# Altium project mb1225.PrjPCB (part 2 of 2)

## Sheet STM32F7.SchDoc: STM32F769NIH6 Connexion
size A3; Date: 29-OCT-2015; Author: A.B; CompanyName: STMicroelectronics; Organization: MCD/TOOLS/GNB; Address1: 12, Rue Jules HOROWITZ; Address2: 38019 Grenoble; Address3: FRANCE; DocumentNumber: MB1225; Revision: B-01; SheetNumber: 4; SheetTotal: 13; Project: STM32F769I-DISCO
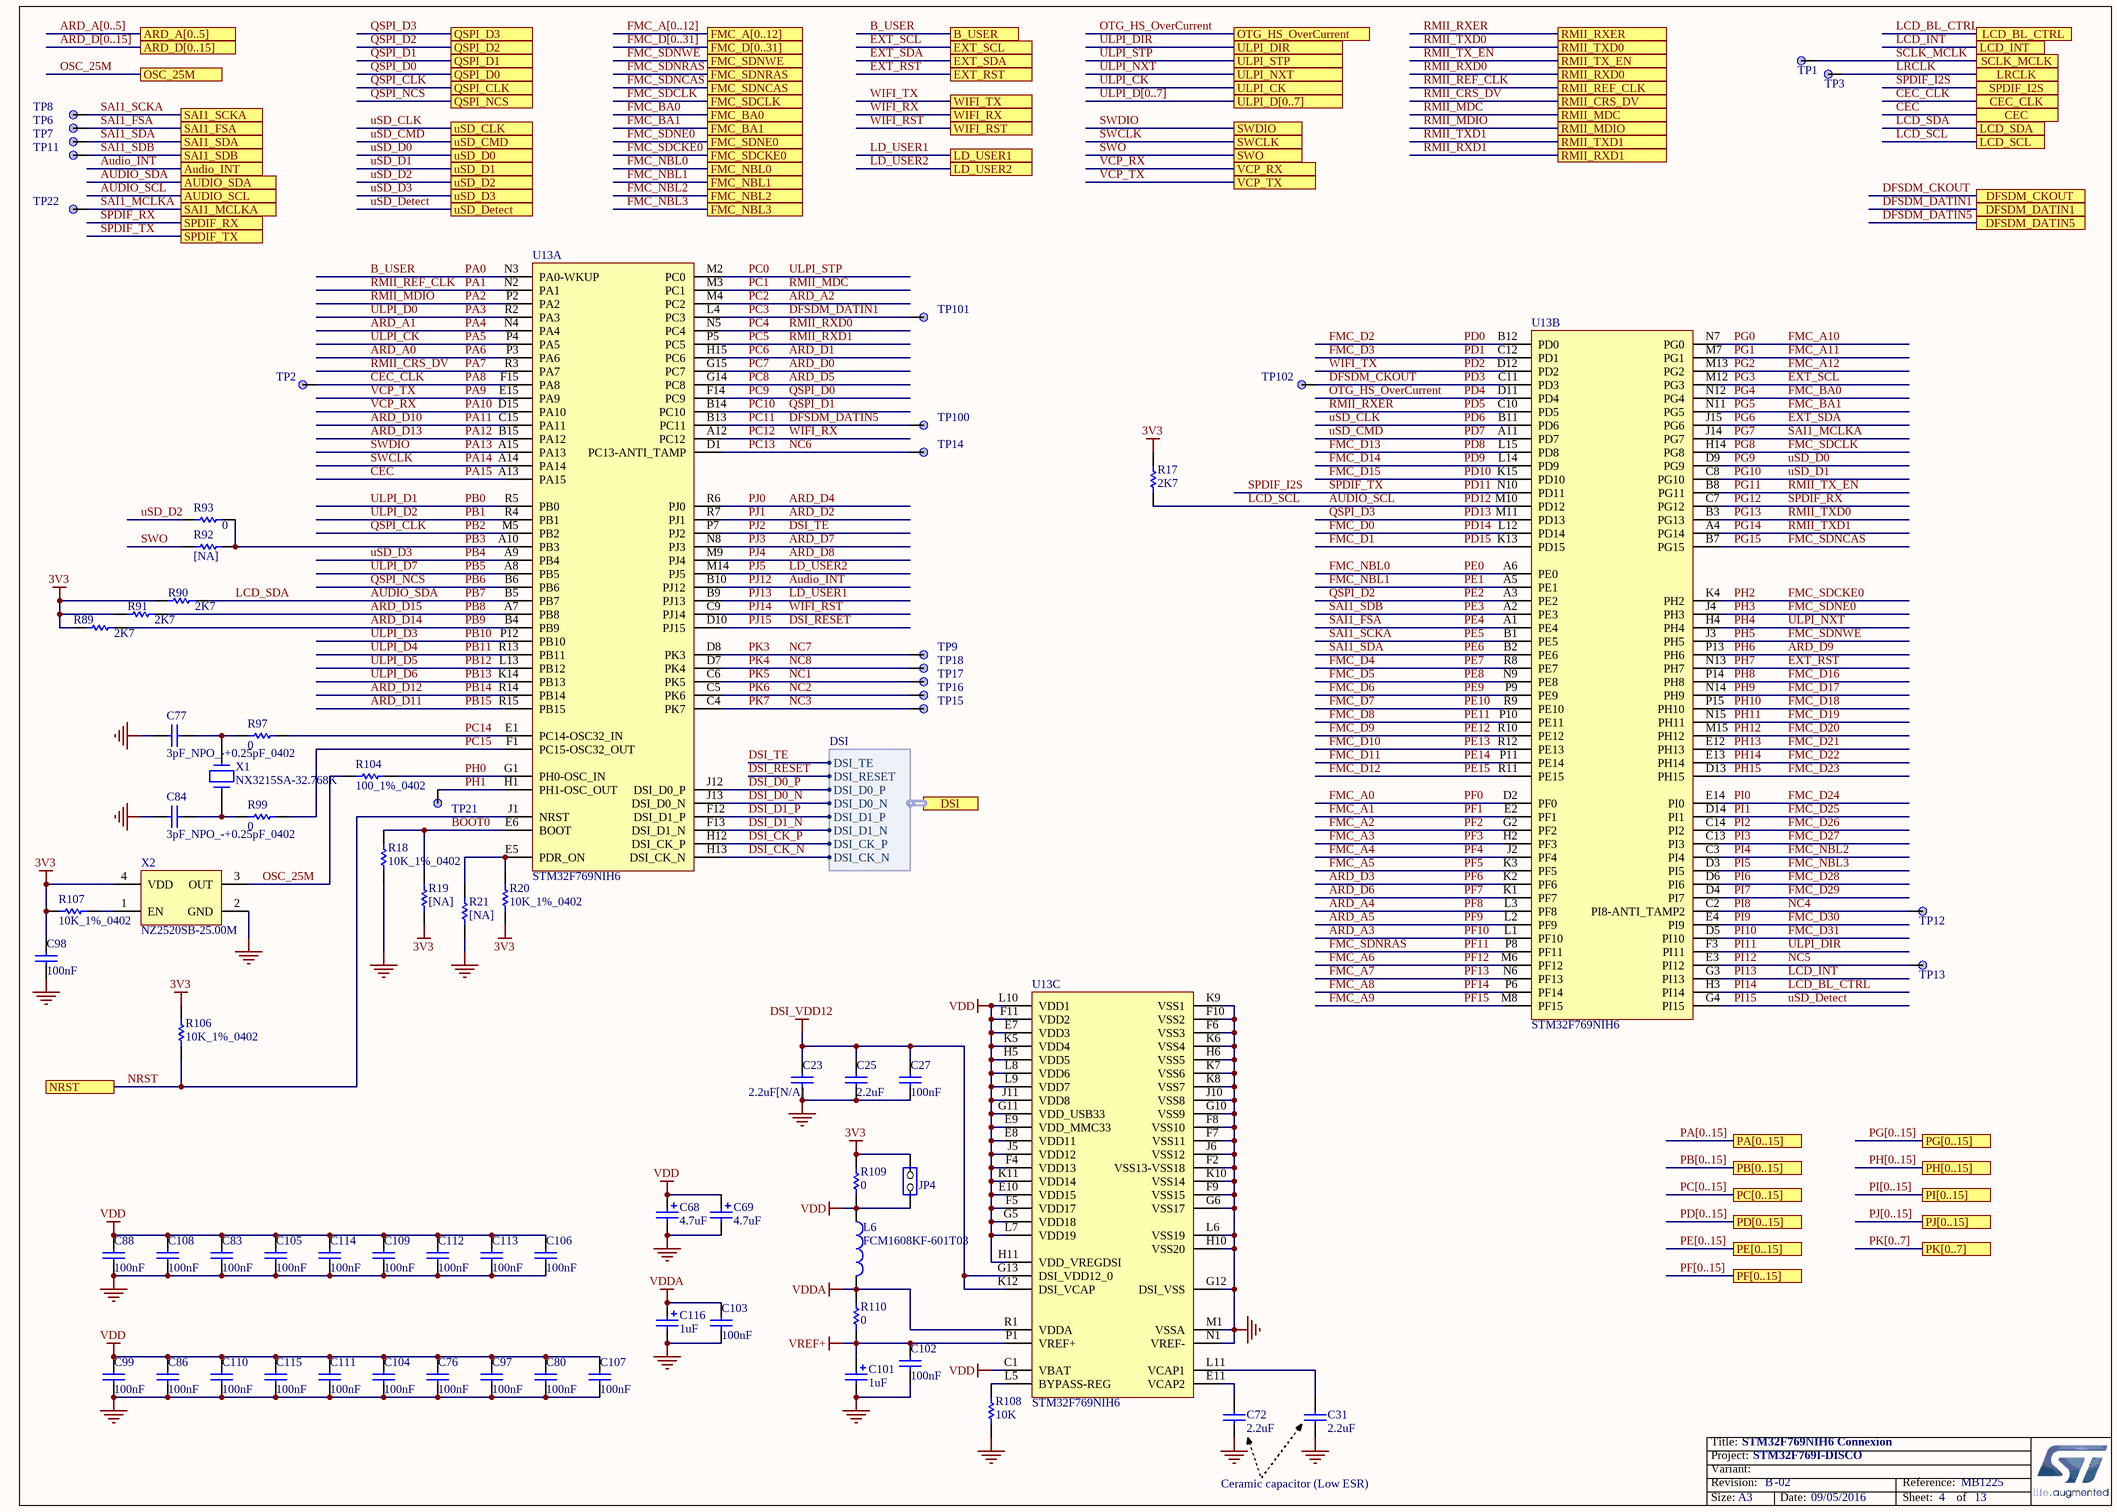
[diagram p5: STM32F7.SchDoc]

### Parts
C23  2.2uF[N/A]  [1206C]
C25  2.2uF  [0603C]
C27  100nF  [0402C]
C31  2.2uF  [1206C]
C68  4.7uF  [TAN-A]
C69  4.7uF  [TAN-A]
C72  2.2uF  [1206C]
C76  100nF  [0402C]
C77  3pF_NPO_-+0.25pF_0402  [0402C]
C80  100nF  [0402C]
C83  100nF  [0402C]
C84  3pF_NPO_-+0.25pF_0402  [0402C]
C86  100nF  [0402C]
C88  100nF  [0402C]
C97  100nF  [0402C]
C98  100nF  [0402C]
C99  100nF  [0402C]
C101  1uF  [TAN-A]
C102  100nF  [0402C]
C103  100nF  [0402C]
C104  100nF  [0402C]
C105  100nF  [0402C]
C106  100nF  [0402C]
C107  100nF  [0402C]
C108  100nF  [0402C]
C109  100nF  [0402C]
C110  100nF  [0402C]
C111  100nF  [0402C]
C112  100nF  [0402C]
C113  100nF  [0402C]
C114  100nF  [0402C]
C115  100nF  [0402C]
C116  1uF  [TAN-A]
JP4  JP2  [SIP2]  (value not drawn)
L6  FCM1608KF-601T03  [0603L]
R17  2K7  [0402R]
R18  10K_1%_0402  [0402R]
R19  [NA]  [0402R]
R20  10K_1%_0402  [0402R]
R21  [NA]  [0402R]
R89  2K7  [0402R]
R90  2K7  [0402R]
R91  2K7  [0402R]
R92  [NA]  [0402R]
R93  0  [0402R]
R97  0  [0402R]
R99  0  [0402R]
R104  100_1%_0402  [0402R]
R106  10K_1%_0402  [0402R]
R107  10K_1%_0402  [0402R]
R108  10K  [0402R]
R109  0  [0603R-GS]
R110  0  [0603R-GS]
TP1  TP  [TP_C40]  (value not drawn)
TP2  TP  [TP_C40]  (value not drawn)
TP3  TP  [TP_C40]  (value not drawn)
TP6  TP  [TP_C40]  (value not drawn)
TP7  TP  [TP_C40]  (value not drawn)
TP8  TP  [TP_C40]  (value not drawn)
TP9  TP  [TP_C40]  (value not drawn)
TP11  TP  [TP_C40]  (value not drawn)
TP12  TP  [TP_C40]  (value not drawn)
TP13  TP  [TP_C40]  (value not drawn)
TP14  TP  [TP_C40]  (value not drawn)
TP15  TP  [TP_C40]  (value not drawn)
TP16  TP  [TP_C40]  (value not drawn)
TP17  TP  [TP_C40]  (value not drawn)
TP18  TP  [TP_C40]  (value not drawn)
TP21  TP  [TP_C40]  (value not drawn)
TP22  TP  [TP_C40]  (value not drawn)
TP100  TP  [TP_C40]  (value not drawn)
TP101  TP  [TP_C40]  (value not drawn)
TP102  TP  [TP_C40]  (value not drawn)
U13  STM32F769NIH6  [BGA216_0R8_13X13]  (parts A,B,C of 3)
X1  NX3215SA-32.768K  [XTAL_2SM_3R2X1R5]
X2  NZ2520SB-25.00M  [OSC_4SM_2R5X2]

### Ports
ARD_A[0..5], ARD_D[0..15], Audio_INT, AUDIO_SCL, AUDIO_SDA, B_USER, CEC, CEC_CLK, DFSDM_CKOUT, DFSDM_DATIN1, DFSDM_DATIN5, DSI (harness DSI), EXT_RST, EXT_SCL, EXT_SDA, FMC_A[0..12], FMC_BA0, FMC_BA1, FMC_D[0..31], FMC_NBL0, FMC_NBL1, FMC_NBL2, FMC_NBL3, FMC_SDCKE0, FMC_SDCLK, FMC_SDNCAS, FMC_SDNE0, FMC_SDNRAS, FMC_SDNWE, LCD_BL_CTRL, LCD_INT, LCD_SCL, LCD_SDA, LD_USER1, LD_USER2, LRCLK, NRST, OSC_25M, OTG_HS_OverCurrent, PA[0..15], PB[0..15], PC[0..15], PD[0..15], PE[0..15], PF[0..15], PG[0..15], PH[0..15], PI[0..15], PJ[0..15], PK[0..7], QSPI_CLK, QSPI_D0, QSPI_D1, QSPI_D2, QSPI_D3, QSPI_NCS, RMII_CRS_DV, RMII_MDC, RMII_MDIO, RMII_REF_CLK, RMII_RXD0, RMII_RXD1, RMII_RXER, RMII_TX_EN, RMII_TXD0, RMII_TXD1, SAI1_FSA, SAI1_MCLKA, SAI1_SCKA, SAI1_SDA, SAI1_SDB, SCLK_MCLK, SPDIF_I2S, SPDIF_RX, SPDIF_TX, SWCLK, SWDIO, SWO, ULPI_CK, ULPI_D[0..7], ULPI_DIR, ULPI_NXT, ULPI_STP, uSD_CLK, uSD_CMD, uSD_D0, uSD_D1, uSD_D2, uSD_D3, uSD_Detect, VCP_RX, VCP_TX, WIFI_RST, WIFI_RX, WIFI_TX

### Harnesses
DSI: DSI_CK_P, DSI_CK_N, DSI_D0_P, DSI_D0_N, DSI_D1_P, DSI_D1_N, DSI_TE, DSI_RESET

### Nets
3V3: C98.2 JP4.2(NO) R17.2 R19.1 R20.1 R89.1 R90.1 R91.1 R106.2 R107.1 R109.2 X2.4(VDD)
DSI_VDD12: C23.2 C25.2 C27.2 U13.G13(DSI_VDD12_0) U13.K12(DSI_VCAP)
GND: C23.1 C25.1 C27.1 C31.1 C68.2 C69.2 C72.1 C76.1 C77.1 C80.1 C83.1 C84.1 C86.1 C88.1 C97.1 C98.1 C99.1 C101.2 C102.1 C103.1 C104.1 C105.1 C106.1 C107.1 C108.1 C109.1 C110.1 C111.1 C112.1 C113.1 C114.1 C115.1 C116.2 R18.1 R21.1 R108.1 U13.F2(VSS13-VSS18) U13.F6(VSS3) U13.F7(VSS11) U13.F8(VSS10) U13.F9(VSS15) U13.F10(VSS2) U13.G6(VSS17) U13.G10(VSS9) U13.G12(DSI_VSS) U13.H6(VSS5) U13.H10(VSS20) U13.J6(VSS12) U13.J10(VSS8) U13.K6(VSS4) U13.K7(VSS6) U13.K8(VSS7) U13.K9(VSS1) U13.K10(VSS14) U13.L6(VSS19) U13.M1(VSSA) U13.N1(VREF-) X2.2(GND)  [project net POE7]
VDD: C68.1 C69.1 C76.2 C80.2 C83.2 C86.2 C88.2 C97.2 C99.2 C104.2 C105.2 C106.2 C107.2 C108.2 C109.2 C110.2 C111.2 C112.2 C113.2 C114.2 C115.2 JP4.1(COMMON) L6.1 R109.1 U13.C1(VBAT) U13.E7(VDD3) U13.E8(VDD11) U13.E9(VDD_MMC33) U13.E10(VDD15) U13.F4(VDD13) U13.F5(VDD17) U13.F11(VDD2) U13.G5(VDD18) U13.G11(VDD_USB33) U13.H5(VDD5) U13.H11(VDD_VREGDSI) U13.J5(VDD12) U13.J11(VDD8) U13.K5(VDD4) U13.K11(VDD14) U13.L7(VDD19) U13.L8(VDD6) U13.L9(VDD7) U13.L10(VDD1)
VDDA: C103.2 C116.1 L6.2 R110.1 U13.R1(VDDA)
VREF+: C101.1 C102.2 R110.2 U13.P1(VREF+)
ARD_A0: U13.P3(PA6)  [also labelled PA6]
ARD_A1: U13.N4(PA4)  [also labelled PA4]
ARD_A2: U13.M4(PC2)  [also labelled PC2]
ARD_A3: U13.L1(PF10)  [also labelled PF10]
ARD_A4: U13.L3(PF8)  [also labelled PF8]
ARD_A5: U13.L2(PF9)  [also labelled PF9]
ARD_D0: U13.G15(PC7)  [also labelled PC7]
ARD_D1: U13.H15(PC6)  [also labelled PC6]
ARD_D2: U13.R7(PJ1)  [also labelled PJ1]
ARD_D3: U13.K2(PF6)  [also labelled PF6]
ARD_D4: U13.R6(PJ0)  [also labelled PJ0]
ARD_D5: U13.G14(PC8)  [also labelled PC8]
ARD_D6: U13.K1(PF7)  [also labelled PF7]
ARD_D7: U13.N8(PJ3)  [also labelled PJ3]
ARD_D8: U13.M9(PJ4)  [also labelled PJ4]
ARD_D9: U13.P13(PH6)  [also labelled PH6]
ARD_D10: U13.C15(PA11)  [also labelled PA11]
ARD_D11: U13.R15(PB15)  [also labelled PB15]
ARD_D12: U13.R14(PB14)  [also labelled PB14]
ARD_D13: U13.B15(PA12)  [also labelled PA12]
ARD_D14: R89.2 U13.B4(PB9)  [also labelled PB9]
ARD_D15: R91.2 U13.A7(PB8)  [also labelled PB8]
Audio_INT: U13.B10(PJ12) ; port Audio_INT  [also labelled PJ12]
AUDIO_SCL: R17.1 U13.M10(PD12) ; port AUDIO_SCL, port LCD_SCL  [also labelled LCD_SCL, PD12]
AUDIO_SDA: R90.2 U13.B5(PB7) ; port AUDIO_SDA, port LCD_SDA  [also labelled LCD_SDA, PB7]
B_USER: U13.N3(PA0-WKUP) ; port B_USER  [also labelled PA0]
BOOT0: R18.2 R19.2 U13.E6(BOOT)
CEC: U13.A13(PA15) ; port CEC  [also labelled PA15]
CEC_CLK: TP2.1 U13.F15(PA8) ; port CEC_CLK  [also labelled PA8]
DFSDM_CKOUT: TP102.1 U13.C11(PD3) ; port DFSDM_CKOUT  [also labelled PD3]
DFSDM_DATIN1: TP101.1 U13.L4(PC3) ; port DFSDM_DATIN1  [also labelled PC3]
DFSDM_DATIN5: TP100.1 U13.B13(PC11) ; port DFSDM_DATIN5  [also labelled PC11]
DSI_CK_N: U13.H13(DSI_CK_N) ; port DSI.DSI_CK_N  [project net DSI.DSI_CK_N]
DSI_CK_P: U13.H12(DSI_CK_P) ; port DSI.DSI_CK_P  [project net DSI.DSI_CK_P]
DSI_D0_N: U13.J13(DSI_D0_N) ; port DSI.DSI_D0_N  [project net DSI.DSI_D0_N]
DSI_D0_P: U13.J12(DSI_D0_P) ; port DSI.DSI_D0_P  [project net DSI.DSI_D0_P]
DSI_D1_N: U13.F13(DSI_D1_N) ; port DSI.DSI_D1_N  [project net DSI.DSI_D1_N]
DSI_D1_P: U13.F12(DSI_D1_P) ; port DSI.DSI_D1_P  [project net DSI.DSI_D1_P]
DSI_RESET: U13.D10(PJ15) ; port DSI.DSI_RESET  [also labelled PJ15]  [project net DSI.DSI_RESET]
DSI_TE: U13.P7(PJ2) ; port DSI.DSI_TE  [also labelled PJ2]  [project net DSI.DSI_TE]
EXT_RST: U13.N13(PH7) ; port EXT_RST  [also labelled PH7]
EXT_SCL: U13.M12(PG3) ; port EXT_SCL  [also labelled PG3]
EXT_SDA: U13.J15(PG6) ; port EXT_SDA  [also labelled PG6]
FMC_A0: U13.D2(PF0)  [also labelled PF0]
FMC_A1: U13.E2(PF1)  [also labelled PF1]
FMC_A2: U13.G2(PF2)  [also labelled PF2]
FMC_A3: U13.H2(PF3)  [also labelled PF3]
FMC_A4: U13.J2(PF4)  [also labelled PF4]
FMC_A5: U13.K3(PF5)  [also labelled PF5]
FMC_A6: U13.M6(PF12)  [also labelled PF12]
FMC_A7: U13.N6(PF13)  [also labelled PF13]
FMC_A8: U13.P6(PF14)  [also labelled PF14]
FMC_A9: U13.M8(PF15)  [also labelled PF15]
FMC_A10: U13.N7(PG0)  [also labelled PG0]
FMC_A11: U13.M7(PG1)  [also labelled PG1]
FMC_A12: U13.M13(PG2)  [also labelled PG2]
FMC_BA0: U13.N12(PG4) ; port FMC_BA0  [also labelled PG4]
FMC_BA1: U13.N11(PG5) ; port FMC_BA1  [also labelled PG5]
FMC_D0: U13.L12(PD14)  [also labelled PD14]
FMC_D1: U13.K13(PD15)  [also labelled PD15]
FMC_D2: U13.B12(PD0)  [also labelled PD0]
FMC_D3: U13.C12(PD1)  [also labelled PD1]
FMC_D4: U13.R8(PE7)  [also labelled PE7]
FMC_D5: U13.N9(PE8)  [also labelled PE8]
FMC_D6: U13.P9(PE9)  [also labelled PE9]
FMC_D7: U13.R9(PE10)  [also labelled PE10]
FMC_D8: U13.P10(PE11)  [also labelled PE11]
FMC_D9: U13.R10(PE12)  [also labelled PE12]
FMC_D10: U13.R12(PE13)  [also labelled PE13]
FMC_D11: U13.P11(PE14)  [also labelled PE14]
FMC_D12: U13.R11(PE15)  [also labelled PE15]
FMC_D13: U13.L15(PD8)  [also labelled PD8]
FMC_D14: U13.L14(PD9)  [also labelled PD9]
FMC_D15: U13.K15(PD10)  [also labelled PD10]
FMC_D16: U13.P14(PH8)  [also labelled PH8]
FMC_D17: U13.N14(PH9)  [also labelled PH9]
FMC_D18: U13.P15(PH10)  [also labelled PH10]
FMC_D19: U13.N15(PH11)  [also labelled PH11]
FMC_D20: U13.M15(PH12)  [also labelled PH12]
FMC_D21: U13.E12(PH13)  [also labelled PH13]
FMC_D22: U13.E13(PH14)  [also labelled PH14]
FMC_D23: U13.D13(PH15)  [also labelled PH15]
FMC_D24: U13.E14(PI0)  [also labelled PI0]
FMC_D25: U13.D14(PI1)  [also labelled PI1]
FMC_D26: U13.C14(PI2)  [also labelled PI2]
FMC_D27: U13.C13(PI3)  [also labelled PI3]
FMC_D28: U13.D6(PI6)  [also labelled PI6]
FMC_D29: U13.D4(PI7)  [also labelled PI7]
FMC_D30: U13.E4(PI9)  [also labelled PI9]
FMC_D31: U13.D5(PI10)  [also labelled PI10]
FMC_NBL0: U13.A6(PE0) ; port FMC_NBL0  [also labelled PE0]
FMC_NBL1: U13.A5(PE1) ; port FMC_NBL1  [also labelled PE1]
FMC_NBL2: U13.C3(PI4) ; port FMC_NBL2  [also labelled PI4]
FMC_NBL3: U13.D3(PI5) ; port FMC_NBL3  [also labelled PI5]
FMC_SDCKE0: U13.K4(PH2) ; port FMC_SDCKE0  [also labelled PH2]
FMC_SDCLK: U13.H14(PG8) ; port FMC_SDCLK  [also labelled PG8]
FMC_SDNCAS: U13.B7(PG15) ; port FMC_SDNCAS  [also labelled PG15]
FMC_SDNE0: U13.J4(PH3) ; port FMC_SDNE0  [also labelled PH3]
FMC_SDNRAS: U13.P8(PF11) ; port FMC_SDNRAS  [also labelled PF11]
FMC_SDNWE: U13.J3(PH5) ; port FMC_SDNWE  [also labelled PH5]
LCD_BL_CTRL: U13.H3(PI14) ; port LCD_BL_CTRL  [also labelled PI14]
LCD_INT: U13.G3(PI13) ; port LCD_INT  [also labelled PI13]
LD_USER1: U13.B9(PJ13) ; port LD_USER1  [also labelled PJ13]
LD_USER2: U13.M14(PJ5) ; port LD_USER2  [also labelled PJ5]
LRCLK: TP3.1 ; port LRCLK
NC1: TP17.1 U13.C6(PK5)  [also labelled PK5]
NC2: TP16.1 U13.C5(PK6)  [also labelled PK6]
NC3: TP15.1 U13.C4(PK7)  [also labelled PK7]
NC4: TP12.1 U13.C2(PI8-ANTI_TAMP2)  [also labelled PI8]
NC5: TP13.1 U13.E3(PI12)  [also labelled PI12]
NC6: TP14.1 U13.D1(PC13-ANTI_TAMP)  [also labelled PC13]
NC7: TP9.1 U13.D8(PK3)  [also labelled PK3]
NC8: TP18.1 U13.D7(PK4)  [also labelled PK4]
NRST: R106.1 U13.J1(NRST) ; port NRST
OSC_25M: R104.1 X2.3(OUT) ; port OSC_25M
OTG_HS_OverCurrent: U13.D11(PD4) ; port OTG_HS_OverCurrent  [also labelled PD4]
PA1: U13.N2(PA1) ; port RMII_REF_CLK  [also labelled RMII_REF_CLK]
PA2: U13.P2(PA2) ; port RMII_MDIO  [also labelled RMII_MDIO]
PA3: U13.R2(PA3)  [also labelled ULPI_D0]
PA5: U13.P4(PA5) ; port ULPI_CK  [also labelled ULPI_CK]
PA7: U13.R3(PA7) ; port RMII_CRS_DV  [also labelled RMII_CRS_DV]
PA9: U13.E15(PA9) ; port VCP_TX  [also labelled VCP_TX]
PA10: U13.D15(PA10) ; port VCP_RX  [also labelled VCP_RX]
PA13: U13.A15(PA13) ; port SWDIO  [also labelled SWDIO]
PA14: U13.A14(PA14) ; port SWCLK  [also labelled SWCLK]
PB0: U13.R5(PB0)  [also labelled ULPI_D1]
PB1: U13.R4(PB1)  [also labelled ULPI_D2]
PB2: U13.M5(PB2) ; port QSPI_CLK  [also labelled QSPI_CLK]
PB3: R92.2 R93.2 U13.A10(PB3)
PB4: U13.A9(PB4) ; port uSD_D3  [also labelled uSD_D3]
PB5: U13.A8(PB5)  [also labelled ULPI_D7]
PB6: U13.B6(PB6) ; port QSPI_NCS  [also labelled QSPI_NCS]
PB10: U13.P12(PB10)  [also labelled ULPI_D3]
PB11: U13.R13(PB11)  [also labelled ULPI_D4]
PB12: U13.L13(PB12)  [also labelled ULPI_D5]
PB13: U13.K14(PB13)  [also labelled ULPI_D6]
PC0: U13.M2(PC0) ; port ULPI_STP  [also labelled ULPI_STP]
PC1: U13.M3(PC1) ; port RMII_MDC  [also labelled RMII_MDC]
PC4: U13.N5(PC4) ; port RMII_RXD0  [also labelled RMII_RXD0]
PC5: U13.P5(PC5) ; port RMII_RXD1  [also labelled RMII_RXD1]
PC9: U13.F14(PC9) ; port QSPI_D0  [also labelled QSPI_D0]
PC10: U13.B14(PC10) ; port QSPI_D1  [also labelled QSPI_D1]
PC12: U13.A12(PC12) ; port WIFI_RX  [also labelled WIFI_RX]
PC14: R97.2 U13.E1(PC14-OSC32_IN)
PC15: R99.2 U13.F1(PC15-OSC32_OUT)
PD2: U13.D12(PD2) ; port WIFI_TX  [also labelled WIFI_TX]
PD5: U13.C10(PD5) ; port RMII_RXER  [also labelled RMII_RXER]
PD6: U13.B11(PD6) ; port uSD_CLK  [also labelled uSD_CLK]
PD7: U13.A11(PD7) ; port uSD_CMD  [also labelled uSD_CMD]
PD11: U13.N10(PD11) ; port SPDIF_TX, port SPDIF_I2S  [also labelled SPDIF_I2S, SPDIF_TX]
PD13: U13.M11(PD13) ; port QSPI_D3  [also labelled QSPI_D3]
PE2: U13.A3(PE2) ; port QSPI_D2  [also labelled QSPI_D2]
PE3: TP11.1 U13.A2(PE3) ; port SAI1_SDB  [also labelled SAI1_SDB]
PE4: TP6.1 U13.A1(PE4) ; port SAI1_FSA  [also labelled SAI1_FSA]
PE5: TP8.1 U13.B1(PE5) ; port SAI1_SCKA  [also labelled SAI1_SCKA]
PE6: TP7.1 U13.B2(PE6) ; port SAI1_SDA  [also labelled SAI1_SDA]
PG7: TP22.1 U13.J14(PG7) ; port SAI1_MCLKA  [also labelled SAI1_MCLKA]
PG9: U13.D9(PG9) ; port uSD_D0  [also labelled uSD_D0]
PG10: U13.C8(PG10) ; port uSD_D1  [also labelled uSD_D1]
PG11: U13.B8(PG11) ; port RMII_TX_EN  [also labelled RMII_TX_EN]
PG12: U13.C7(PG12) ; port SPDIF_RX  [also labelled SPDIF_RX]
PG13: U13.B3(PG13) ; port RMII_TXD0  [also labelled RMII_TXD0]
PG14: U13.A4(PG14) ; port RMII_TXD1  [also labelled RMII_TXD1]
PH0: R104.2 U13.G1(PH0-OSC_IN)
PH1: TP21.1 U13.H1(PH1-OSC_OUT)
PH4: U13.H4(PH4) ; port ULPI_NXT  [also labelled ULPI_NXT]
PI11: U13.F3(PI11) ; port ULPI_DIR  [also labelled ULPI_DIR]
PI15: U13.G4(PI15) ; port uSD_Detect  [also labelled uSD_Detect]
PJ14: U13.C9(PJ14) ; port WIFI_RST  [also labelled WIFI_RST]
SCLK_MCLK: TP1.1 ; port SCLK_MCLK
SWO: R92.1 ; port SWO
uSD_D2: R93.1 ; port uSD_D2
NetC31_2: C31.2 U13.L11(VCAP1)
NetC72_2: C72.2 U13.E11(VCAP2)
NetC77_2: C77.2 R97.1 X1.1
NetC84_2: C84.2 R99.1 X1.2
NetR20_2: R20.2 R21.2 U13.E5(PDR_ON)
NetR107_2: R107.2 X2.1(EN)
NetR108_2: R108.2 U13.L5(BYPASS-REG)

### Buses and harness runs
bus ARD_A[0..5] = port ARD_A[0..5]
bus ARD_D[0..15] = port ARD_D[0..15]
bus FMC_A[0..12] = port FMC_A[0..12]
bus FMC_D[0..31] = port FMC_D[0..31]
bus PA[0..15] = port PA[0..15]
bus PB[0..15] = port PB[0..15]
bus PC[0..15] = port PC[0..15]
bus PD[0..15] = port PD[0..15]
bus PE[0..15] = port PE[0..15]
bus PF[0..15] = port PF[0..15]
bus PG[0..15] = port PG[0..15]
bus PH[0..15] = port PH[0..15]
bus PI[0..15] = port PI[0..15]
bus PJ[0..15] = port PJ[0..15]
bus PK[0..7] = port PK[0..7]
bus ULPI_D[0..7] = port ULPI_D[0..7]

### Notes on the sheet
- Ceramic capacitor (Low ESR)
- Title:
- Project:
- Size:
- Revision:
- Variant:
- A3
- -
- Date:
- Reference:
- Sheet:
- of

### Library data of the parts
C23 = Cap_2.2uF_X7R_10%_1206: Capacitor,2.2uF,16V, X7R,10%,1206,YAGEO; Manuf_Part_1: CC1206KKX7R7BB225; Manuf_Part_2: C1206C225K4RAC; Manuf_2: KEMET; Fitted: NO; Revision: July-2002: Re-released for DXP Platform.; Value: 2.2uF; Order: CC1206KKX7R7BB225; Manuf_1: YAGEO; ECCN_US/EU: n/a
C25 = Cap_2.2uF_X5R_10%_0603: Capacitor,2.2uF,10V, X5R,10%,0603,YAGEO; Manuf_Part_1: CC0603KRX5R6BB225; Manuf_Part_2: C0603C225K8PACTU; Manuf_2: KEMET; Revision: July-2002: Re-released for DXP Platform.; Value: 2.2uF; Order: *; Manuf_1: YAGEO; ECCN_US/EU: n/a
C27 C76 C80 C83 C86 C88 C97-C99 C102-C115 = Cap_100nF_X7R_10%_0402: Capacitor,100nF,16V,X7R,10%,0402,YAGEO; Manuf_Part_1: CC0402KRX7R7BB104; Revision: July-2002: Re-released for DXP Platform.; Value: 100nF; Order: CC0402KRX7R7BB104; Manuf_1: YAGEO
  C27: ECCN_US/EU: n/a
C31 C72 = Cap_2.2uF_X7R_10%_1206: Capacitor,2.2uF,16V, X7R,10%,1206,YAGEO; Manuf_Part_1: CC1206KKX7R7BB225; Manuf_Part_2: C1206C225K4RAC; Manuf_2: KEMET; Revision: July-2002: Re-released for DXP Platform.; Value: 2.2uF; Order: CC1206KKX7R7BB225; Manuf_1: YAGEO; ECCN_US/EU: n/a
C68 C69 = Cap_4.7uF_POL_10%_TANA: Polarized Capacitor,4.7uF,16V,10%,typeA,AVX; Manuf_Part_1: TAJA475K016R; Revision: July-2002: Re-released for DXP Platform.; Value: 4.7uF; Manuf_1: AVX; Order: TAJA475K016R; ECCN_US/EU: n/a
C77 C84 = Cap_4.3pF_NPO_-+0.25pF_0402: Capacitor, 3pF, 16V, NPO, -+0.25pF, 0402, KEMET; Manuf_1: AVX; Manuf_Part_1: C0402C439C4GACTU; Order: C0402C439C4GACTU-ND; Revision: July-2002: Re-released for DXP Platform.; Value: 3pF; ECCN_US/EU: n/a; Distrib: DIGIKEY
C101 C116 = Cap_1uF_POL_10%_TANA: Polarized Capacitor,1uF,16V,10%,typeA,AVX; Manuf_Part_1: TAJA105K016R; Revision: July-2002: Re-released for DXP Platform.; Value: 1uF; Manuf_1: AVX; Distrib: *; Order: TAJA105K016R; ECCN_US/EU: n/a
JP4 = JP2: Fitted: NO; ECCN_US/EU: n/a
L6 = BEAD_600R_350MA_0603: Bead,600R,350mA,0603,FCM1608KF-601T03,Tai-tech; Manuf_2: TDK; Manuf_Part_2: MPZ1608S300A; Manuf_Part_3: BLM18PG121SN1D; Manuf_3: MURATA; Value: 100uH; Description_2: Bead,30R,5A,0603,MPZ1608S300A,TDK; Description_3: Bead,120R,2A,0603,BLM18PG121SN1D,MURATA; Revision: July-2002: Re-released for DXP Platform.; Manuf_Part_1: FCM1608KF-601T03; Manuf_1: Tai-tech; ECCN_US/EU: n/a
R17 R89-R91 = Res_2K7_1%_0402: Resistor,2K7,0402,1%,YAGEO; Manuf_Part_1: RC0402FR-072K7L; Value: 2K7; Manuf_1: YAGEO; Order: RC0402FR-072K7L; ECCN_US/EU: n/a; Distrib: FARNELL
R18 R20 R106-R108 = Res_10K_1%_0402: Resistor,10K,0402,1%,YAGEO; Manuf_Part_1: RC0402FR-0710KL; Value: 10K; Manuf_1: YAGEO; Order: RC0402FR-0710KL; ECCN_US/EU: n/a
R19 R21 R92 = Res_NA_0402: Resistor,[NA],0402; Fitted: NO; Value: [NA]; ECCN_US/EU: n/a
R93 R97 R99 = Res_0_5%_0402: Resistor,0,0402,5%,YAGEO; Manuf_Part_1: RC0402JR-070RL; Order: 2363467; Value: 0; ECCN_US/EU: n/a; Manuf_1: YAGEO; Distrib: FARNELL
R104 = Res_100_1%_0402: Resistor,100,0402,1%,YAGEO; Manuf_Part_1: RC0402FR-07100RL; Value: 100; Order: 9239111; Manuf_1: YAGEO; ECCN_US/EU: n/a; Distrib: FARNELL
R109 R110 = Res_0_5%_0603: Resistor,0,0603,5%,YAGEO; Manuf_Part_1: RC0603JR-070RL; Order: 2363481; Value: 0; ECCN_US/EU: n/a; Manuf_1: YAGEO; Distrib: FARNELL
TP1-TP3 TP6-TP9 TP11-TP18 TP21 TP22 TP100-TP102 = TP: Test Point; ECCN_US/EU: n/a
U13 = STM32F769NIH6U: STM32F769NIH6 (STM32F7 Big Birdie) TBGA216; Manuf_1: STM; ECCN_US/EU: 3A991A2/NEC; Ref St: xxxxxxxx; Provided: ST; Distrib: ST; Manuf_Part_1: STM32F769NIH6U; Order: STM32F769NIH6U
X1 = XTAL_32K_NX3215SA: Crystal 32.768kHz, 6pF, -+20PPM, R=50K, SMD; Manuf_1: NDK; Manuf_Part_1: NX3215SA 32.768KHz EXS00A-MU00525; ECCN_US/EU: EAR99/NEC; Ref St: 9157034; NDK Ref: X3101802; Provided: ST; Distrib: *; Order: NX3215SA 32.768KHz EXS00A-MU00525
X2 = OSC_25M_NZ2520SB: Oscillator 25.00Mhz, -+50PPM, 3.3V, Temp -55 to +125°C; Manuf_Part_1: NZ2520SB 25MHz END4869B; Manuf_1: NDK; Manuf_Part_2: KC2520B25.0000C10E00; Manuf_2: AVX Corp/Kyocera Corp; ECCN_US/EU: EAR99/NEC; Ref St: 9157031; Provided: ST; Order: *

## Sheet DSI_LCD.SchDoc: MIPI connector for DSI LCD and HDMI boards.
size A4; Date: 29-OCT-2015; Author: A.B; CompanyName: STMicroelectronics; Organization: MCD/TOOLS/GNB; Address1: 12, Rue Jules HOROWITZ; Address2: 38019 Grenoble; Address3: FRANCE; DocumentNumber: MB1225; Revision: B-01; SheetNumber: 12; SheetTotal: 13; Project: STM32F769I-DISCO
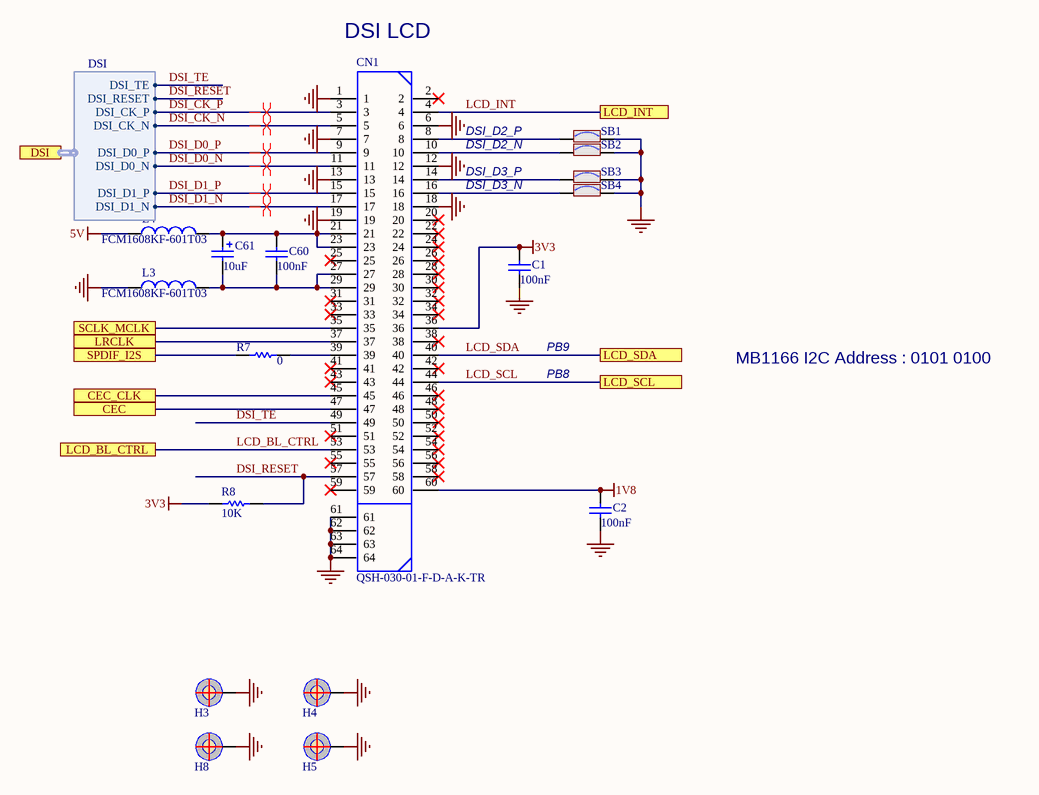
[diagram p6: DSI_LCD.SchDoc]

### Parts
C1  100nF  [0603C]
C2  100nF  [0603C]
C60  100nF  [0603C]
C61  10uF  [TAN-A]
CN1  QSH-030-01-F-D-A-K-TR  [QSH-030-01-F-D-A]
H3  POSITION HOLE  [HOLE_C9D4R5-1]  (value not drawn)
H4  POSITION HOLE  [HOLE_C9D4R5]  (value not drawn)
H5  POSITION HOLE  [HOLE_C9D4R5]  (value not drawn)
H8  POSITION HOLE  [HOLE_C9D4R5-1]  (value not drawn)
L3  FCM1608KF-601T03  [0603L]
L4  FCM1608KF-601T03  [0603L]
R7  0  [0402R]
R8  10K  [0402R]
SB1  Solder Bridge ON  [JP2_SMD]  (value not drawn)
SB2  Solder Bridge ON  [JP2_SMD]  (value not drawn)
SB3  Solder Bridge ON  [JP2_SMD]  (value not drawn)
SB4  Solder Bridge ON  [JP2_SMD]  (value not drawn)

### Ports
CEC, CEC_CLK, DSI (harness DSI), LCD_BL_CTRL, LCD_INT, LCD_SCL, LCD_SDA, LRCLK, SCLK_MCLK, SPDIF_I2S

### Harnesses
DSI: DSI_CK_P, DSI_CK_N, DSI_D0_P, DSI_D0_N, DSI_D1_P, DSI_D1_N, DSI_TE, DSI_RESET

### Nets
1V8: C2.2 CN1.60
3V3: C1.2 CN1.36 R8.1
5V: L4.1
GND: C1.1 C2.1 CN1.1 CN1.6 CN1.7 CN1.12 CN1.13 CN1.18 CN1.19 CN1.61 CN1.62 CN1.63 CN1.64 H3.1 H4.1 H5.1 H8.1 L3.1 SB1.2 SB2.2 SB3.2 SB4.2  [project net POE7]
CEC: CN1.47 ; port CEC
CEC_CLK: CN1.45 ; port CEC_CLK
DSI_CK_N: CN1.5 ; port DSI.DSI_CK_N  [project net DSI.DSI_CK_N]
DSI_CK_P: CN1.3 ; port DSI.DSI_CK_P  [project net DSI.DSI_CK_P]
DSI_D0_N: CN1.11 ; port DSI.DSI_D0_N  [project net DSI.DSI_D0_N]
DSI_D0_P: CN1.9 ; port DSI.DSI_D0_P  [project net DSI.DSI_D0_P]
DSI_D1_N: CN1.17 ; port DSI.DSI_D1_N  [project net DSI.DSI_D1_N]
DSI_D1_P: CN1.15 ; port DSI.DSI_D1_P  [project net DSI.DSI_D1_P]
DSI_RESET: CN1.57 R8.2 ; port DSI.DSI_RESET  [project net DSI.DSI_RESET]
DSI_TE: CN1.49 ; port DSI.DSI_TE  [project net DSI.DSI_TE]
LCD_BL_CTRL: CN1.53 ; port LCD_BL_CTRL
LCD_INT: CN1.4 ; port LCD_INT
LCD_SCL: CN1.44 ; port LCD_SCL  [project net AUDIO_SCL]
LCD_SDA: CN1.40 ; port LCD_SDA  [project net AUDIO_SDA]
LRCLK: CN1.37 ; port LRCLK
PD11: R7.1 ; port SPDIF_I2S
SCLK_MCLK: CN1.35 ; port SCLK_MCLK
NetC60_1: C60.1 C61.2 CN1.27 CN1.29 L3.2
NetC60_2: C60.2 C61.1 CN1.21 CN1.23 L4.2
NetCN1_8: CN1.8 SB1.1
NetCN1_10: CN1.10 SB2.1
NetCN1_14: CN1.14 SB3.1
NetCN1_16: CN1.16 SB4.1
NetCN1_39: CN1.39 R7.2

Not connected (* = marked no-connect by the designer): CN1 2* 20* 22* 24* 25* 26* 28* 30* 31* 32* 33* 34* 38* 41* 42* 43* 46* 48* 50* 51* 52* 54* 55* 56* 58* 59*

### Layout directives
differential pair: DSI.DSI_CK_N, DSI.DSI_CK_P, DSI.DSI_D0_N, DSI.DSI_D0_P, DSI.DSI_D1_N, DSI.DSI_D1_P

### Notes on the sheet
- DSI LCD
- DSI_D2_P
- DSI_D2_N
- DSI_D3_P
- DSI_D3_N
- PB9
- PB8
- MB1166 I2C Address : 0101 0100
- Title:
- Project:
- Size:
- Revision:
- Variant:
- A4
- -
- Date:
- Reference:
- Sheet:
- of

### Library data of the parts
C1 C2 C60 = Cap_100nF_X7R_10%_0603: Capacitor,100nF,16V,X7R,10%,0603,YAGEO; Manuf_Part_1: CC0603KRX7R9BB104; Revision: July-2002: Re-released for DXP Platform.; Value: 100nF; Order: CC0603KRX7R9BB104; Manuf_1: YAGEO; ECCN_US/EU: n/a
C61 = Cap_10uF_POL_10%_TANA: Polarized Capacitor,10uF,10V,10%,typeA,VISHAY; Manuf_Part_1: 293D106X9010A2TE3; Revision: July-2002: Re-released for DXP Platform.; Value: 10uF; Manuf_1: VISHAY; Order: *; ECCN_US/EU: n/a
CN1 = QSH-030-01-F-D-A: HIGH SPEED SOCKET STRIP, .5mm PITCH, 60 PINS; Manuf_1: SAMTEC; Provided: Sub Co; Ref St: 9183715; Manuf_Part_1: QSH-030-01-F-D-A-K-TR; ECCN_US/EU: n/a
L3 L4 = BEAD_600R_350MA_0603: as L6 on sheet STM32F7; Revision: July-2002: Re-released for DXP Platform.; Manuf_Part_1: FCM1608KF-601T03; Manuf_1: Tai-tech; ECCN_US/EU: n/a
R7 = Res_0_5%_0402: as R93 on sheet STM32F7; Value: 0; ECCN_US/EU: n/a; Manuf_1: YAGEO; Distrib: FARNELL
R8 = Res_10K_1%_0402: as R18 on sheet STM32F7; Value: 10K; Manuf_1: YAGEO; Order: RC0402FR-0710KL; ECCN_US/EU: n/a
SB1-SB4 = SB_ON: Solder: YES; Revision: July-2002: Re-released for DXP Platform.; ECCN_US/EU: n/a

## Nets that join several sheets
1V8: AUDIO (6 pins), DSI_LCD (C2.2 CN1.60)
3V3: AUDIO (24 pins), QSPI (C96.2 R86.2 U12.8 U250.8), SDRAM (28 pins), STM32F7 (12 pins), DSI_LCD (C1.2 CN1.36 R8.1)
POE7: PoE (15 pins), TOP (H1.1 H2.1 H6.1 H7.1), AUDIO (55 pins), QSPI (C96.1 U12.4 U250.4), SDRAM (28 pins), STM32F7 (58 pins), DSI_LCD (22 pins)
Audio_INT: AUDIO (U11.G3), STM32F7 (U13.B10)
AUDIO_SCL: AUDIO (R88.1), STM32F7 (R17.1 U13.M10), DSI_LCD (CN1.44)
AUDIO_SDA: AUDIO (R95.1), STM32F7 (R90.2 U13.B5), DSI_LCD (CN1.40)
CEC: STM32F7 (U13.A13), DSI_LCD (CN1.47)
CEC_CLK: STM32F7 (TP2.1 U13.F15), DSI_LCD (CN1.45)
DFSDM_CKOUT: AUDIO (5 pins), STM32F7 (TP102.1 U13.C11)
DFSDM_DATIN1: AUDIO (TP103.1 U5.4 U6.4), STM32F7 (TP101.1 U13.L4)
DFSDM_DATIN5: AUDIO (TP104.1 U8.4 U9.4), STM32F7 (TP100.1 U13.B13)
DSI.DSI_CK_N: STM32F7 (U13.H13), DSI_LCD (CN1.5)
DSI.DSI_CK_P: STM32F7 (U13.H12), DSI_LCD (CN1.3)
DSI.DSI_D0_N: STM32F7 (U13.J13), DSI_LCD (CN1.11)
DSI.DSI_D0_P: STM32F7 (U13.J12), DSI_LCD (CN1.9)
DSI.DSI_D1_N: STM32F7 (U13.F13), DSI_LCD (CN1.17)
DSI.DSI_D1_P: STM32F7 (U13.F12), DSI_LCD (CN1.15)
DSI.DSI_RESET: STM32F7 (U13.D10), DSI_LCD (CN1.57 R8.2)
DSI.DSI_TE: STM32F7 (U13.P7), DSI_LCD (CN1.49)
FMC_A0: SDRAM (U17.G8), STM32F7 (U13.D2)
FMC_A1: SDRAM (U17.G9), STM32F7 (U13.E2)
FMC_A2: SDRAM (U17.F7), STM32F7 (U13.G2)
FMC_A3: SDRAM (U17.F3), STM32F7 (U13.H2)
FMC_A4: SDRAM (U17.G1), STM32F7 (U13.J2)
FMC_A5: SDRAM (U17.G2), STM32F7 (U13.K3)
FMC_A6: SDRAM (U17.G3), STM32F7 (U13.M6)
FMC_A7: SDRAM (U17.H1), STM32F7 (U13.N6)
FMC_A8: SDRAM (U17.H2), STM32F7 (U13.P6)
FMC_A9: SDRAM (U17.J3), STM32F7 (U13.M8)
FMC_A10: SDRAM (U17.G7), STM32F7 (U13.N7)
FMC_A11: SDRAM (U17.H9), STM32F7 (U13.M7)
FMC_A12: SDRAM (U17.E3), STM32F7 (U13.M13)
FMC_BA0: SDRAM (U17.J7), STM32F7 (U13.N12)
FMC_BA1: SDRAM (U17.H8), STM32F7 (U13.N11)
FMC_D0: SDRAM (TP27.1 U17.R8), STM32F7 (U13.L12)
FMC_D1: SDRAM (U17.N7), STM32F7 (U13.K13)
FMC_D2: SDRAM (U17.R9), STM32F7 (U13.B12)
FMC_D3: SDRAM (U17.N8), STM32F7 (U13.C12)
FMC_D4: SDRAM (U17.P9), STM32F7 (U13.R8)
FMC_D5: SDRAM (U17.M8), STM32F7 (U13.N9)
FMC_D6: SDRAM (U17.M7), STM32F7 (U13.P9)
FMC_D7: SDRAM (U17.L8), STM32F7 (U13.R9)
FMC_D8: SDRAM (U17.L2), STM32F7 (U13.P10)
FMC_D9: SDRAM (U17.M3), STM32F7 (U13.R10)
FMC_D10: SDRAM (U17.M2), STM32F7 (U13.R12)
FMC_D11: SDRAM (U17.P1), STM32F7 (U13.P11)
FMC_D12: SDRAM (U17.N2), STM32F7 (U13.R11)
FMC_D13: SDRAM (U17.R1), STM32F7 (U13.L15)
FMC_D14: SDRAM (U17.N3), STM32F7 (U13.L14)
FMC_D15: SDRAM (U17.R2), STM32F7 (U13.K15)
FMC_D16: SDRAM (U17.E8), STM32F7 (U13.P14)
FMC_D17: SDRAM (U17.D7), STM32F7 (U13.N14)
FMC_D18: SDRAM (U17.D8), STM32F7 (U13.P15)
FMC_D19: SDRAM (U17.B9), STM32F7 (U13.N15)
FMC_D20: SDRAM (U17.C8), STM32F7 (U13.M15)
FMC_D21: SDRAM (U17.A9), STM32F7 (U13.E12)
FMC_D22: SDRAM (U17.C7), STM32F7 (U13.E13)
FMC_D23: SDRAM (U17.A8), STM32F7 (U13.D13)
FMC_D24: SDRAM (U17.A2), STM32F7 (U13.E14)
FMC_D25: SDRAM (U17.C3), STM32F7 (U13.D14)
FMC_D26: SDRAM (U17.A1), STM32F7 (U13.C14)
FMC_D27: SDRAM (U17.C2), STM32F7 (U13.C13)
FMC_D28: SDRAM (U17.B1), STM32F7 (U13.D6)
FMC_D29: SDRAM (U17.D2), STM32F7 (U13.D4)
FMC_D30: SDRAM (U17.D3), STM32F7 (U13.E4)
FMC_D31: SDRAM (U17.E2), STM32F7 (U13.D5)
FMC_NBL0: SDRAM (U17.K9), STM32F7 (U13.A6)
FMC_NBL1: SDRAM (U17.K1), STM32F7 (U13.A5)
FMC_NBL2: SDRAM (U17.F8), STM32F7 (U13.C3)
FMC_NBL3: SDRAM (U17.F2), STM32F7 (U13.D3)
FMC_SDCKE0: SDRAM (U17.J2), STM32F7 (U13.K4)
FMC_SDCLK: SDRAM (TP26.1 U17.J1), STM32F7 (U13.H14)
FMC_SDNCAS: SDRAM (U17.K7), STM32F7 (U13.B7)
FMC_SDNE0: SDRAM (U17.J8), STM32F7 (U13.J4)
FMC_SDNRAS: SDRAM (U17.J9), STM32F7 (U13.P8)
FMC_SDNWE: SDRAM (TP28.1 U17.K8), STM32F7 (U13.J3)
LCD_BL_CTRL: STM32F7 (U13.H3), DSI_LCD (CN1.53)
LCD_INT: STM32F7 (U13.G3), DSI_LCD (CN1.4)
LRCLK: STM32F7 (TP3.1), DSI_LCD (CN1.37)
PB2: QSPI (U12.6 U250.6), STM32F7 (U13.M5)
PB6: QSPI (R86.1 U12.1 U250.1), STM32F7 (U13.B6)
PC9: QSPI (U12.5 U250.5), STM32F7 (U13.F14)
PC10: QSPI (U12.2 U250.2), STM32F7 (U13.B14)
PD11: AUDIO (R100.1 TP20.1), STM32F7 (U13.N10), DSI_LCD (R7.1)
PD13: QSPI (U12.7 U250.7), STM32F7 (U13.M11)
PE2: QSPI (U12.3 U250.3), STM32F7 (U13.A3)
PE3: AUDIO (U11.F2), STM32F7 (TP11.1 U13.A2)
PE4: AUDIO (U11.E3), STM32F7 (TP6.1 U13.A1)
PE5: AUDIO (U11.G1), STM32F7 (TP8.1 U13.B1)
PE6: AUDIO (U11.E4), STM32F7 (TP7.1 U13.B2)
PG7: AUDIO (U11.D3), STM32F7 (TP22.1 U13.J14)
PG12: AUDIO (R112.2 R114.2 U15.4), STM32F7 (U13.C7)
SCLK_MCLK: STM32F7 (TP1.1), DSI_LCD (CN1.35)